# Altium schematic sheet MIPI_CSI-2.SchDoc
size A2
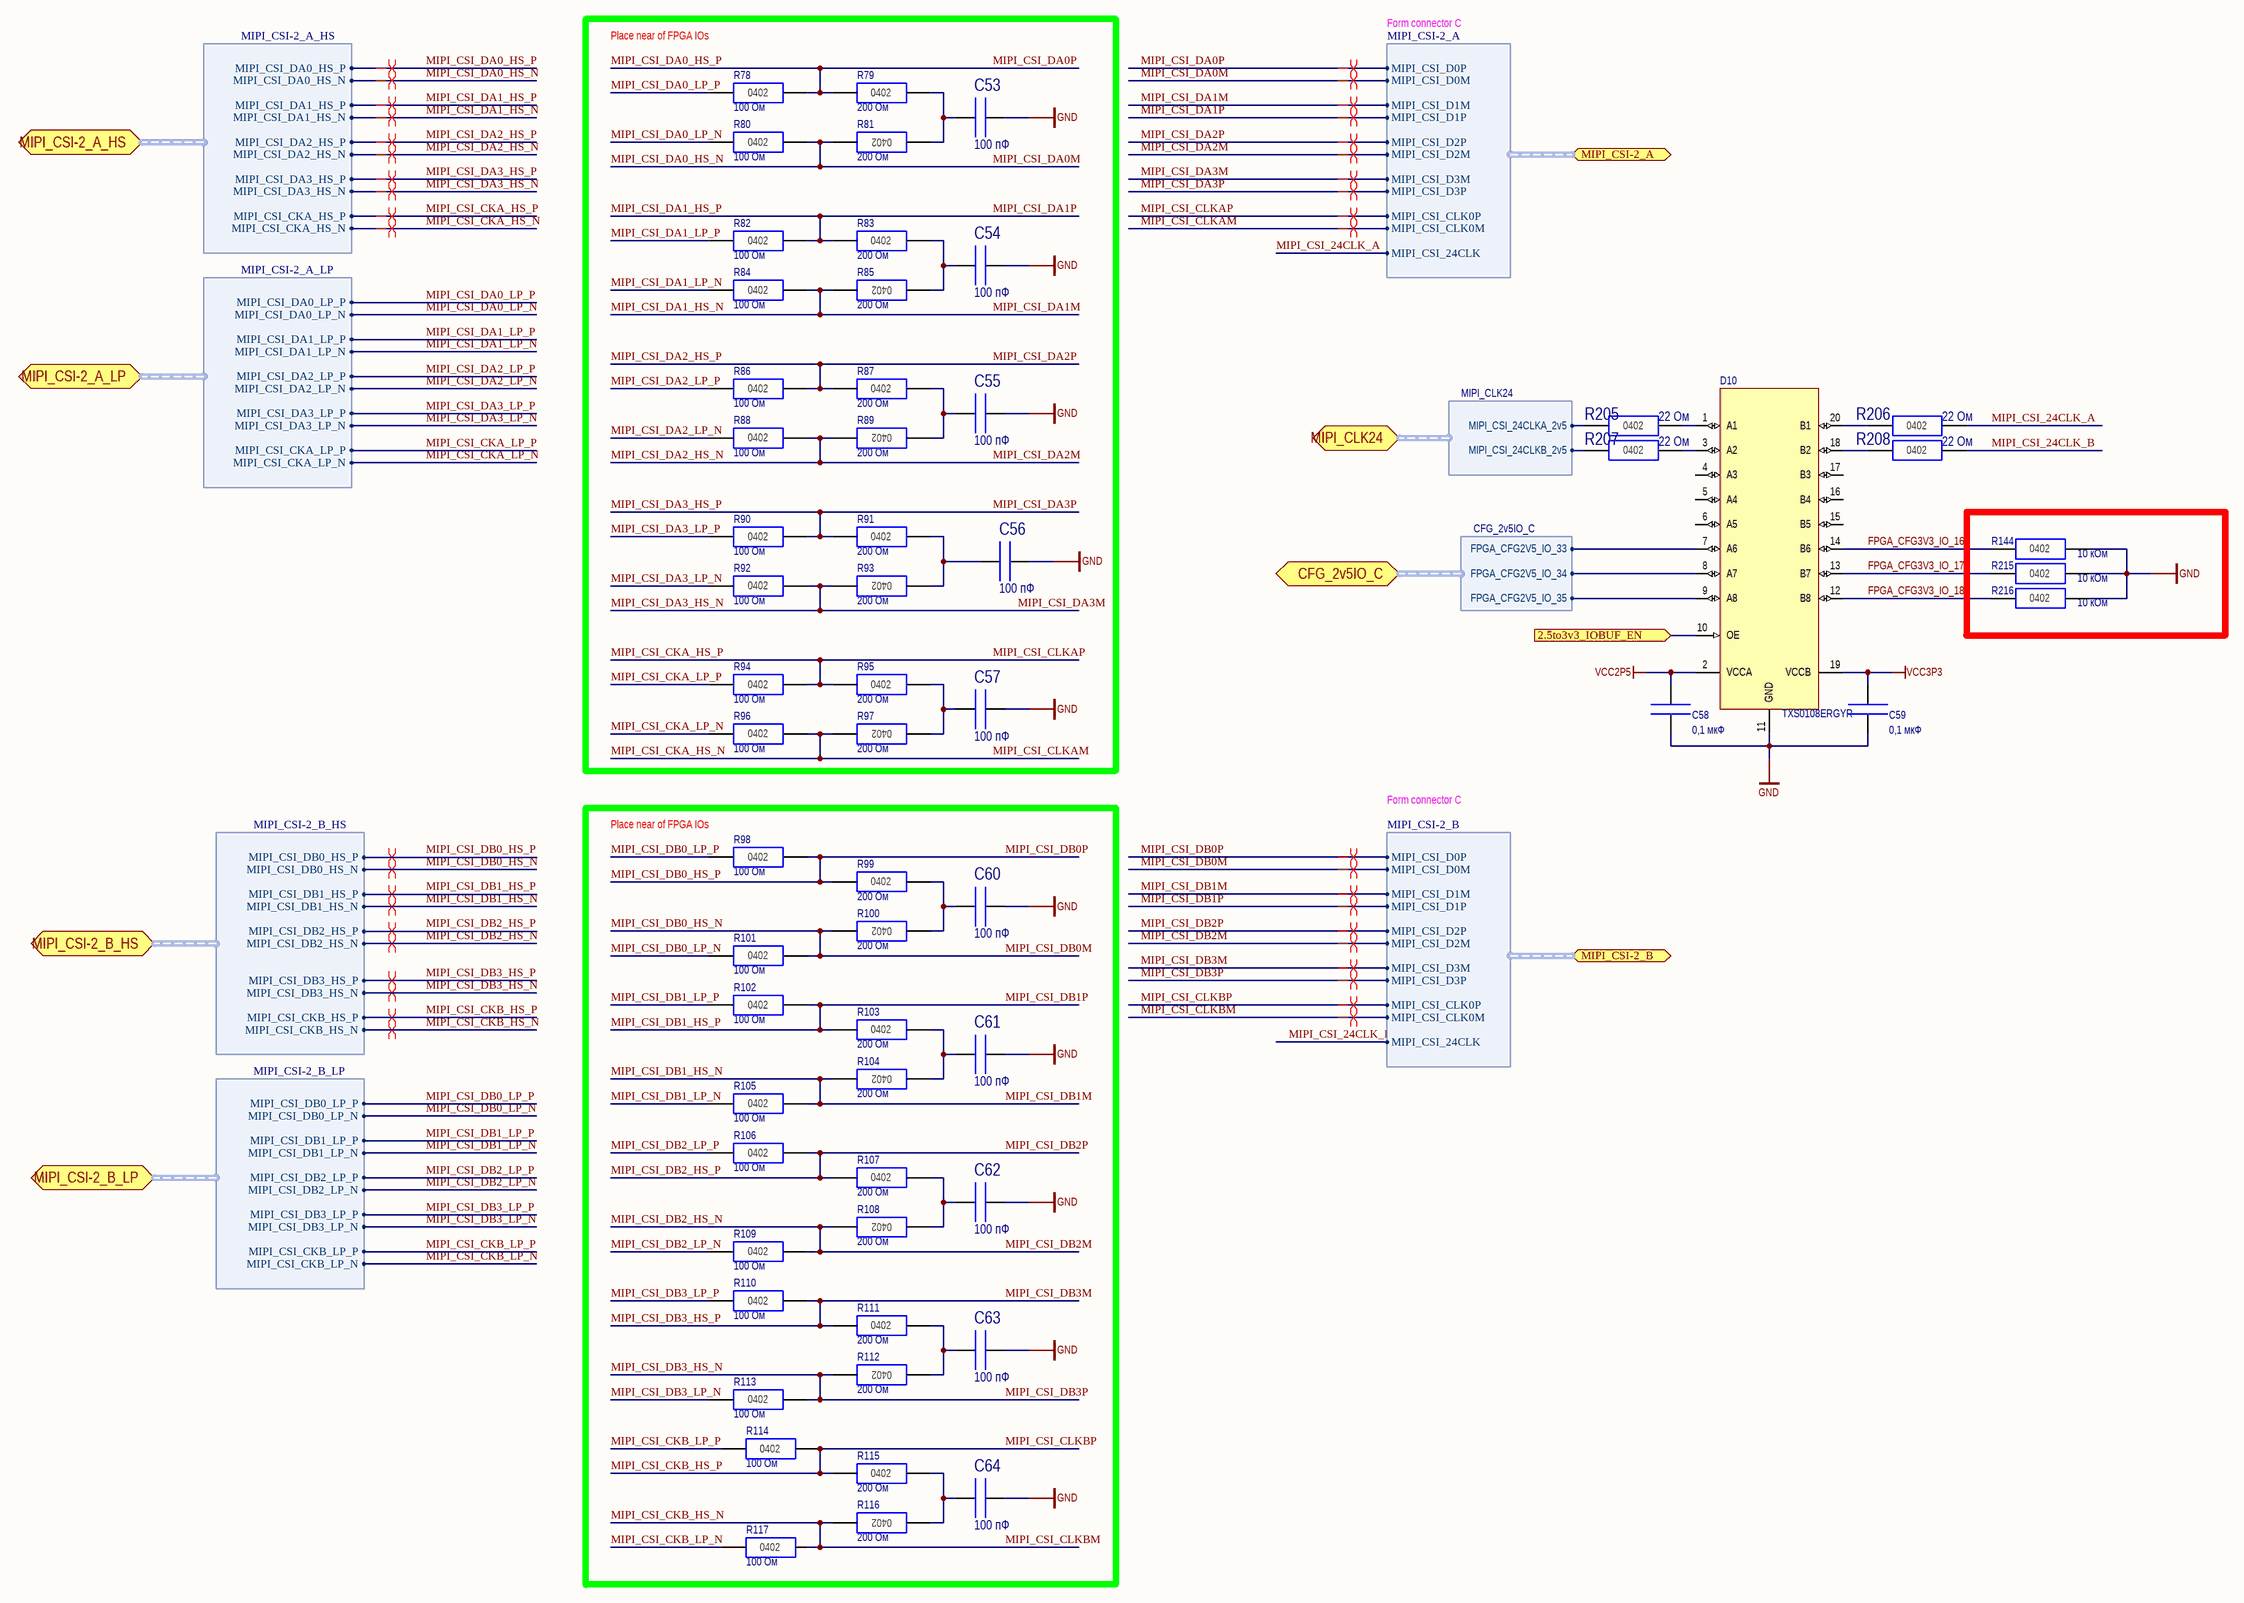
[diagram p0: MIPI_CSI-2.SchDoc]

## Parts
C53  value 100 пФ  [CC0402(1005)]  (hidden comment: CC0402-NP0-100 пФ-1%-50В)
C54  value 100 пФ  [CC0402(1005)]  (hidden comment: CC0402-NP0-100 пФ-1%-50В)
C55  value 100 пФ  [CC0402(1005)]  (hidden comment: CC0402-NP0-100 пФ-1%-50В)
C56  value 100 пФ  [CC0402(1005)]  (hidden comment: CC0402-NP0-100 пФ-1%-50В)
C57  value 100 пФ  [CC0402(1005)]  (hidden comment: CC0402-NP0-100 пФ-1%-50В)
C58  value 0,1 мкФ  [CC0402(1005)]  (hidden comment: CC0402-X7R-0,1 мкФ-20%-10В)
C59  value 0,1 мкФ  [CC0402(1005)]  (hidden comment: CC0402-X7R-0,1 мкФ-20%-10В)
C60  value 100 пФ  [CC0402(1005)]  (hidden comment: CC0402-NP0-100 пФ-1%-50В)
C61  value 100 пФ  [CC0402(1005)]  (hidden comment: CC0402-NP0-100 пФ-1%-50В)
C62  value 100 пФ  [CC0402(1005)]  (hidden comment: CC0402-NP0-100 пФ-1%-50В)
C63  value 100 пФ  [CC0402(1005)]  (hidden comment: CC0402-NP0-100 пФ-1%-50В)
C64  value 100 пФ  [CC0402(1005)]  (hidden comment: CC0402-NP0-100 пФ-1%-50В)
D10  TXS0108ERGYR  [QFN50P450X350X100_HS-21N]
R78  value 100 Ом  [CR0402(1005)]  (hidden comment: CR0402-100 Ом-±5%)
R79  value 200 Ом  [CR0402(1005)]  (hidden comment: CR0402-200 Ом-±5%)
R80  value 100 Ом  [CR0402(1005)]  (hidden comment: CR0402-100 Ом-±5%)
R81  value 200 Ом  [CR0402(1005)]  (hidden comment: CR0402-200 Ом-±5%)
R82  value 100 Ом  [CR0402(1005)]  (hidden comment: CR0402-100 Ом-±5%)
R83  value 200 Ом  [CR0402(1005)]  (hidden comment: CR0402-200 Ом-±5%)
R84  value 100 Ом  [CR0402(1005)]  (hidden comment: CR0402-100 Ом-±5%)
R85  value 200 Ом  [CR0402(1005)]  (hidden comment: CR0402-200 Ом-±5%)
R86  value 100 Ом  [CR0402(1005)]  (hidden comment: CR0402-100 Ом-±5%)
R87  value 200 Ом  [CR0402(1005)]  (hidden comment: CR0402-200 Ом-±5%)
R88  value 100 Ом  [CR0402(1005)]  (hidden comment: CR0402-100 Ом-±5%)
R89  value 200 Ом  [CR0402(1005)]  (hidden comment: CR0402-200 Ом-±5%)
R90  value 100 Ом  [CR0402(1005)]  (hidden comment: CR0402-100 Ом-±5%)
R91  value 200 Ом  [CR0402(1005)]  (hidden comment: CR0402-200 Ом-±5%)
R92  value 100 Ом  [CR0402(1005)]  (hidden comment: CR0402-100 Ом-±5%)
R93  value 200 Ом  [CR0402(1005)]  (hidden comment: CR0402-200 Ом-±5%)
R94  value 100 Ом  [CR0402(1005)]  (hidden comment: CR0402-100 Ом-±5%)
R95  value 200 Ом  [CR0402(1005)]  (hidden comment: CR0402-200 Ом-±5%)
R96  value 100 Ом  [CR0402(1005)]  (hidden comment: CR0402-100 Ом-±5%)
R97  value 200 Ом  [CR0402(1005)]  (hidden comment: CR0402-200 Ом-±5%)
R98  value 100 Ом  [CR0402(1005)]  (hidden comment: CR0402-100 Ом-±5%)
R99  value 200 Ом  [CR0402(1005)]  (hidden comment: CR0402-200 Ом-±5%)
R100  value 200 Ом  [CR0402(1005)]  (hidden comment: CR0402-200 Ом-±5%)
R101  value 100 Ом  [CR0402(1005)]  (hidden comment: CR0402-100 Ом-±5%)
R102  value 100 Ом  [CR0402(1005)]  (hidden comment: CR0402-100 Ом-±5%)
R103  value 200 Ом  [CR0402(1005)]  (hidden comment: CR0402-200 Ом-±5%)
R104  value 200 Ом  [CR0402(1005)]  (hidden comment: CR0402-200 Ом-±5%)
R105  value 100 Ом  [CR0402(1005)]  (hidden comment: CR0402-100 Ом-±5%)
R106  value 100 Ом  [CR0402(1005)]  (hidden comment: CR0402-100 Ом-±5%)
R107  value 200 Ом  [CR0402(1005)]  (hidden comment: CR0402-200 Ом-±5%)
R108  value 200 Ом  [CR0402(1005)]  (hidden comment: CR0402-200 Ом-±5%)
R109  value 100 Ом  [CR0402(1005)]  (hidden comment: CR0402-100 Ом-±5%)
R110  value 100 Ом  [CR0402(1005)]  (hidden comment: CR0402-100 Ом-±5%)
R111  value 200 Ом  [CR0402(1005)]  (hidden comment: CR0402-200 Ом-±5%)
R112  value 200 Ом  [CR0402(1005)]  (hidden comment: CR0402-200 Ом-±5%)
R113  value 100 Ом  [CR0402(1005)]  (hidden comment: CR0402-100 Ом-±5%)
R114  value 100 Ом  [CR0402(1005)]  (hidden comment: CR0402-100 Ом-±5%)
R115  value 200 Ом  [CR0402(1005)]  (hidden comment: CR0402-200 Ом-±5%)
R116  value 200 Ом  [CR0402(1005)]  (hidden comment: CR0402-200 Ом-±5%)
R117  value 100 Ом  [CR0402(1005)]  (hidden comment: CR0402-100 Ом-±5%)
R144  value 10 кОм  [CR0402(1005)]  (hidden comment: CR0402-10 кОм-±5%)
R205  value 22 Ом  [CR0402(1005)]  (hidden comment: CR0402-22 Ом-±5%)
R206  value 22 Ом  [CR0402(1005)]  (hidden comment: CR0402-22 Ом-±5%)
R207  value 22 Ом  [CR0402(1005)]  (hidden comment: CR0402-22 Ом-±5%)
R208  value 22 Ом  [CR0402(1005)]  (hidden comment: CR0402-22 Ом-±5%)
R215  value 10 кОм  [CR0402(1005)]  (hidden comment: CR0402-10 кОм-±5%)
R216  value 10 кОм  [CR0402(1005)]  (hidden comment: CR0402-10 кОм-±5%)

## Blocks framed on the sheet
Place near of FPGA IOs: C53-C57 R78-R97
Place near of FPGA IOs: C60-C64 R98-R117

## Ports
2.5to3v3_IOBUF_EN (in), CFG_2v5IO_C (harness CFG_2v5IO_C), MIPI_CLK24 (harness MIPI_CLK24), MIPI_CSI-2_A (harness MIPI_CSI-2_A), MIPI_CSI-2_A_HS (harness MIPI_CSI-2_A_HS), MIPI_CSI-2_A_LP (harness MIPI_CSI-2_A_LP), MIPI_CSI-2_B (harness MIPI_CSI-2_B), MIPI_CSI-2_B_HS (harness MIPI_CSI-2_B_HS), MIPI_CSI-2_B_LP (harness MIPI_CSI-2_B_LP)

## Harnesses
MIPI_CSI-2_A: MIPI_CSI_D0P, MIPI_CSI_D0M, MIPI_CSI_D1M, MIPI_CSI_D1P, MIPI_CSI_D2P, MIPI_CSI_D2M, MIPI_CSI_D3M, MIPI_CSI_D3P, MIPI_CSI_CLK0P, MIPI_CSI_CLK0M, MIPI_CSI_24CLK
MIPI_CSI-2_B: MIPI_CSI_D0P, MIPI_CSI_D0M, MIPI_CSI_D1M, MIPI_CSI_D1P, MIPI_CSI_CLK0P, MIPI_CSI_CLK0M, MIPI_CSI_24CLK, MIPI_CSI_D2P, MIPI_CSI_D2M, MIPI_CSI_D3M, MIPI_CSI_D3P
MIPI_CSI-2_A_HS: MIPI_CSI_DA0_HS_N, MIPI_CSI_DA0_HS_P, MIPI_CSI_DA1_HS_N, MIPI_CSI_DA1_HS_P, MIPI_CSI_DA2_HS_P, MIPI_CSI_DA2_HS_N, MIPI_CSI_DA3_HS_N, MIPI_CSI_DA3_HS_P, MIPI_CSI_CKA_HS_N, MIPI_CSI_CKA_HS_P
MIPI_CSI-2_A_LP: MIPI_CSI_DA0_LP_P, MIPI_CSI_DA0_LP_N, MIPI_CSI_DA1_LP_P, MIPI_CSI_DA1_LP_N, MIPI_CSI_DA2_LP_N, MIPI_CSI_DA2_LP_P, MIPI_CSI_DA3_LP_P, MIPI_CSI_DA3_LP_N, MIPI_CSI_CKA_LP_P, MIPI_CSI_CKA_LP_N
MIPI_CSI-2_B_LP: MIPI_CSI_DB0_LP_P, MIPI_CSI_DB0_LP_N, MIPI_CSI_DB1_LP_P, MIPI_CSI_DB1_LP_N, MIPI_CSI_DB2_LP_N, MIPI_CSI_DB2_LP_P, MIPI_CSI_DB3_LP_P, MIPI_CSI_DB3_LP_N, MIPI_CSI_CKB_LP_P, MIPI_CSI_CKB_LP_N
MIPI_CSI-2_B_HS: MIPI_CSI_DB0_HS_N, MIPI_CSI_DB0_HS_P, MIPI_CSI_DB1_HS_N, MIPI_CSI_DB1_HS_P, MIPI_CSI_DB2_HS_N, MIPI_CSI_DB2_HS_P, MIPI_CSI_DB3_HS_N, MIPI_CSI_DB3_HS_P, MIPI_CSI_CKB_HS_N, MIPI_CSI_CKB_HS_P
MIPI_CLK24: MIPI_CSI_24CLKA_2v5, MIPI_CSI_24CLKB_2v5
CFG_2v5IO_C: FPGA_CFG2V5_IO_33, FPGA_CFG2V5_IO_34, FPGA_CFG2V5_IO_35

## Nets
GND: C53.1(+) C54.1(+) C55.1(+) C56.1(+) C57.1(+) C58.2(-) C59.2(-) C60.1(+) C61.1(+) C62.1(+) C63.1(+) C64.1(+) D10.11(GND) R144.2(-) R215.2(-) R216.2(-)
VCC2P5: C58.1(+) D10.2(VCCA)
VCC3P3: C59.1(+) D10.19(VCCB)
2.5to3v3_IOBUF_EN: D10.10(OE) ; port 2.5to3v3_IOBUF_EN
FPGA_CFG3V3_IO_16: D10.14(B6) R144.1(+)
FPGA_CFG3V3_IO_17: D10.13(B7) R215.1(+)
FPGA_CFG3V3_IO_18: D10.12(B8) R216.1(+)
MIPI_CSI_24CLK_A: R206.2(-) ; port MIPI_CSI-2_A.MIPI_CSI_24CLK
MIPI_CSI_24CLK_B: R208.2(-) ; port MIPI_CSI-2_B.MIPI_CSI_24CLK
MIPI_CSI_CKA_HS_N: R96.2(-) R97.2(-) ; port MIPI_CSI-2_A.MIPI_CSI_CLK0M, port MIPI_CSI-2_A_HS.MIPI_CSI_CKA_HS_N  [also labelled MIPI_CSI_CLKAM]
MIPI_CSI_CKA_HS_P: R94.2(-) R95.1(+) ; port MIPI_CSI-2_A.MIPI_CSI_CLK0P, port MIPI_CSI-2_A_HS.MIPI_CSI_CKA_HS_P  [also labelled MIPI_CSI_CLKAP]
MIPI_CSI_CKA_LP_N: R96.1(+) ; port MIPI_CSI-2_A_LP.MIPI_CSI_CKA_LP_N
MIPI_CSI_CKA_LP_P: R94.1(+) ; port MIPI_CSI-2_A_LP.MIPI_CSI_CKA_LP_P
MIPI_CSI_CKB_HS_N: R116.2(-) R117.2(-) ; port MIPI_CSI-2_B.MIPI_CSI_CLK0M, port MIPI_CSI-2_B_HS.MIPI_CSI_CKB_HS_N  [also labelled MIPI_CSI_CLKBM]
MIPI_CSI_CKB_HS_P: R114.2(-) R115.1(+) ; port MIPI_CSI-2_B.MIPI_CSI_CLK0P, port MIPI_CSI-2_B_HS.MIPI_CSI_CKB_HS_P  [also labelled MIPI_CSI_CLKBP]
MIPI_CSI_CKB_LP_N: R117.1(+) ; port MIPI_CSI-2_B_LP.MIPI_CSI_CKB_LP_N
MIPI_CSI_CKB_LP_P: R114.1(+) ; port MIPI_CSI-2_B_LP.MIPI_CSI_CKB_LP_P
MIPI_CSI_DA0_HS_N: R80.2(-) R81.2(-) ; port MIPI_CSI-2_A.MIPI_CSI_D0M, port MIPI_CSI-2_A_HS.MIPI_CSI_DA0_HS_N  [also labelled MIPI_CSI_DA0M]
MIPI_CSI_DA0_HS_P: R78.2(-) R79.1(+) ; port MIPI_CSI-2_A.MIPI_CSI_D0P, port MIPI_CSI-2_A_HS.MIPI_CSI_DA0_HS_P  [also labelled MIPI_CSI_DA0P]
MIPI_CSI_DA0_LP_N: R80.1(+) ; port MIPI_CSI-2_A_LP.MIPI_CSI_DA0_LP_N
MIPI_CSI_DA0_LP_P: R78.1(+) ; port MIPI_CSI-2_A_LP.MIPI_CSI_DA0_LP_P
MIPI_CSI_DA1_HS_N: R84.2(-) R85.2(-) ; port MIPI_CSI-2_A.MIPI_CSI_D1M, port MIPI_CSI-2_A_HS.MIPI_CSI_DA1_HS_N  [also labelled MIPI_CSI_DA1M]
MIPI_CSI_DA1_HS_P: R82.2(-) R83.1(+) ; port MIPI_CSI-2_A.MIPI_CSI_D1P, port MIPI_CSI-2_A_HS.MIPI_CSI_DA1_HS_P  [also labelled MIPI_CSI_DA1P]
MIPI_CSI_DA1_LP_N: R84.1(+) ; port MIPI_CSI-2_A_LP.MIPI_CSI_DA1_LP_N
MIPI_CSI_DA1_LP_P: R82.1(+) ; port MIPI_CSI-2_A_LP.MIPI_CSI_DA1_LP_P
MIPI_CSI_DA2_HS_N: R88.2(-) R89.2(-) ; port MIPI_CSI-2_A.MIPI_CSI_D2M, port MIPI_CSI-2_A_HS.MIPI_CSI_DA2_HS_N  [also labelled MIPI_CSI_DA2M]
MIPI_CSI_DA2_HS_P: R86.2(-) R87.1(+) ; port MIPI_CSI-2_A.MIPI_CSI_D2P, port MIPI_CSI-2_A_HS.MIPI_CSI_DA2_HS_P  [also labelled MIPI_CSI_DA2P]
MIPI_CSI_DA2_LP_N: R88.1(+) ; port MIPI_CSI-2_A_LP.MIPI_CSI_DA2_LP_N
MIPI_CSI_DA2_LP_P: R86.1(+) ; port MIPI_CSI-2_A_LP.MIPI_CSI_DA2_LP_P
MIPI_CSI_DA3_HS_N: R92.2(-) R93.2(-) ; port MIPI_CSI-2_A.MIPI_CSI_D3M, port MIPI_CSI-2_A_HS.MIPI_CSI_DA3_HS_N  [also labelled MIPI_CSI_DA3M]
MIPI_CSI_DA3_HS_P: R90.2(-) R91.1(+) ; port MIPI_CSI-2_A.MIPI_CSI_D3P, port MIPI_CSI-2_A_HS.MIPI_CSI_DA3_HS_P  [also labelled MIPI_CSI_DA3P]
MIPI_CSI_DA3_LP_N: R92.1(+) ; port MIPI_CSI-2_A_LP.MIPI_CSI_DA3_LP_N
MIPI_CSI_DA3_LP_P: R90.1(+) ; port MIPI_CSI-2_A_LP.MIPI_CSI_DA3_LP_P
MIPI_CSI_DB0_HS_N: R100.2(-) R101.2(-) ; port MIPI_CSI-2_B.MIPI_CSI_D0M, port MIPI_CSI-2_B_HS.MIPI_CSI_DB0_HS_N  [also labelled MIPI_CSI_DB0M]
MIPI_CSI_DB0_HS_P: R98.2(-) R99.1(+) ; port MIPI_CSI-2_B.MIPI_CSI_D0P, port MIPI_CSI-2_B_HS.MIPI_CSI_DB0_HS_P  [also labelled MIPI_CSI_DB0P]
MIPI_CSI_DB0_LP_N: R101.1(+) ; port MIPI_CSI-2_B_LP.MIPI_CSI_DB0_LP_N
MIPI_CSI_DB0_LP_P: R98.1(+) ; port MIPI_CSI-2_B_LP.MIPI_CSI_DB0_LP_P
MIPI_CSI_DB1_HS_N: R104.2(-) R105.2(-) ; port MIPI_CSI-2_B.MIPI_CSI_D1M, port MIPI_CSI-2_B_HS.MIPI_CSI_DB1_HS_N  [also labelled MIPI_CSI_DB1M]
MIPI_CSI_DB1_HS_P: R102.2(-) R103.1(+) ; port MIPI_CSI-2_B.MIPI_CSI_D1P, port MIPI_CSI-2_B_HS.MIPI_CSI_DB1_HS_P  [also labelled MIPI_CSI_DB1P]
MIPI_CSI_DB1_LP_N: R105.1(+) ; port MIPI_CSI-2_B_LP.MIPI_CSI_DB1_LP_N
MIPI_CSI_DB1_LP_P: R102.1(+) ; port MIPI_CSI-2_B_LP.MIPI_CSI_DB1_LP_P
MIPI_CSI_DB2_HS_N: R108.2(-) R109.2(-) ; port MIPI_CSI-2_B.MIPI_CSI_D2M, port MIPI_CSI-2_B_HS.MIPI_CSI_DB2_HS_N  [also labelled MIPI_CSI_DB2M]
MIPI_CSI_DB2_HS_P: R106.2(-) R107.1(+) ; port MIPI_CSI-2_B.MIPI_CSI_D2P, port MIPI_CSI-2_B_HS.MIPI_CSI_DB2_HS_P  [also labelled MIPI_CSI_DB2P]
MIPI_CSI_DB2_LP_N: R109.1(+) ; port MIPI_CSI-2_B_LP.MIPI_CSI_DB2_LP_N
MIPI_CSI_DB2_LP_P: R106.1(+) ; port MIPI_CSI-2_B_LP.MIPI_CSI_DB2_LP_P
MIPI_CSI_DB3_HS_N: R112.2(-) R113.2(-) ; port MIPI_CSI-2_B.MIPI_CSI_D3P, port MIPI_CSI-2_B_HS.MIPI_CSI_DB3_HS_N  [also labelled MIPI_CSI_DB3P]
MIPI_CSI_DB3_HS_P: R110.2(-) R111.1(+) ; port MIPI_CSI-2_B.MIPI_CSI_D3M, port MIPI_CSI-2_B_HS.MIPI_CSI_DB3_HS_P  [also labelled MIPI_CSI_DB3M]
MIPI_CSI_DB3_LP_N: R113.1(+) ; port MIPI_CSI-2_B_LP.MIPI_CSI_DB3_LP_N
MIPI_CSI_DB3_LP_P: R110.1(+) ; port MIPI_CSI-2_B_LP.MIPI_CSI_DB3_LP_P
NetC53_2: C53.2(-) R79.2(-) R81.1(+)
NetC54_2: C54.2(-) R83.2(-) R85.1(+)
NetC55_2: C55.2(-) R87.2(-) R89.1(+)
NetC56_2: C56.2(-) R91.2(-) R93.1(+)
NetC57_2: C57.2(-) R95.2(-) R97.1(+)
NetC60_2: C60.2(-) R99.2(-) R100.1(+)
NetC61_2: C61.2(-) R103.2(-) R104.1(+)
NetC62_2: C62.2(-) R107.2(-) R108.1(+)
NetC63_2: C63.2(-) R111.2(-) R112.1(+)
NetC64_2: C64.2(-) R115.2(-) R116.1(+)
NetD10_1: D10.1(A1) R205.2(-)
NetD10_3: D10.3(A2) R207.2(-)
NetD10_7: D10.7(A6) ; port CFG_2v5IO_C.FPGA_CFG2V5_IO_33
NetD10_8: D10.8(A7) ; port CFG_2v5IO_C.FPGA_CFG2V5_IO_34
NetD10_9: D10.9(A8) ; port CFG_2v5IO_C.FPGA_CFG2V5_IO_35
NetD10_18: D10.18(B2) R208.1(+)
NetD10_20: D10.20(B1) R206.1(+)
NetR205_1: R205.1(+) ; port MIPI_CLK24.MIPI_CSI_24CLKA_2v5
NetR207_1: R207.1(+) ; port MIPI_CLK24.MIPI_CSI_24CLKB_2v5

Not connected (* = marked no-connect by the designer): D10 4(A3) 5(A4) 6(A5) 15(B5) 16(B4) 17(B3)

## Layout directives
differential pair: MIPI_CSI_CKA_HS_N, MIPI_CSI_CKA_HS_P, MIPI_CSI_CKB_HS_N, MIPI_CSI_CKB_HS_P, MIPI_CSI_DA0_HS_N, MIPI_CSI_DA0_HS_P, MIPI_CSI_DA1_HS_N, MIPI_CSI_DA1_HS_P, MIPI_CSI_DA2_HS_N, MIPI_CSI_DA2_HS_P, MIPI_CSI_DA3_HS_N, MIPI_CSI_DA3_HS_P, MIPI_CSI_DB0_HS_N, MIPI_CSI_DB0_HS_P, MIPI_CSI_DB1_HS_N, MIPI_CSI_DB1_HS_P, MIPI_CSI_DB2_HS_N, MIPI_CSI_DB2_HS_P, MIPI_CSI_DB3_HS_N, MIPI_CSI_DB3_HS_P

## Notes on the sheet
- Form connector C
- (in symbol CR0402-#-±5%) 0402

## Library data of the parts
C53-C64 = CC0402-X7R-#-20%-10В: Чип конденсатор керамический; Supplier 1: Digi-Key
  C53-C57 C60-C64: Supplier Part Number 1: 490-8180-2-ND
  C58 C59: Supplier Part Number 1: 399-3520-1-ND
D10 = TXS0108ERGYR: 8-Bit Bidirectional Voltage-Level Translator with Auto Direction Sensing and +/-15-kV ESD Protect, VQFN-20 LARGE T&R; Generic Part Number: TXB0108; Manufacturer: Texas Instruments; VCC(Min)(V): 1.2; VCC(Max)(V): 5.5; Output Type: CMOS; Logic: True; ICC @ Nom Voltage(Max)(mA): 0.005; Input Type: CMOS/TTL; Bits(#): 8; Rating: Catalog; Voltage(Nom)(V): 3.3; Schmitt Trigger: No; Sub-Family: Dual Supply Translator; tpd @ Nom Voltage(Max)(ns): 4.9; PackageReference: VQFN-20; Supplier 1: Mouser; Supplier Part Number 1: 595-TXS0108ERGYR; Supplier 2: Digi-Key; Supplier Part Number 2: 296-24806-2-ND; Supplier 3: Digi-Key; Supplier Part Number 3: 296-24806-1-ND; Supplier 4: Digi-Key; Supplier Part Number 4: 296-24806-6-ND; Operating Temperature Range(C): -40 to 85; 3-State Output: No; PartNumber: TXS0108ERGYR; ComponentLink1Description: Manufacturer URL; ComponentLink1URL: http://www.ti.com/; ComponentLink2Description: Datasheet; ComponentLink2URL: http://www.ti.com/lit/ds/symlink/txs0108e.pdf
R78-R117 R144 R205-R208 R215 R216 = CR0402-#-±5%: Чип резистор; Maximum Working Voltage: 50 В; TOLERANCE: 5%; Supplier 1: Digi-Key
  R78 R80 R82 R84 R86 R88 R90 R92 R94 R96 R98 R101 R102 R105 R106 R109 R110 R113 R114 R117: Supplier Part Number 1: 311-100JRTR-ND
  R79 R81 R83 R85 R87 R89 R91 R93 R95 R97 R99 R100 R103 R104 R107 R108 R111 R112 R115 R116: Supplier Part Number 1: 311-200JRTR-ND
  R144 R215 R216: Supplier Part Number 1: 311-10.0KJRTR-ND
  R205-R208: Supplier Part Number 1: 311-10.0KLRDKR-ND